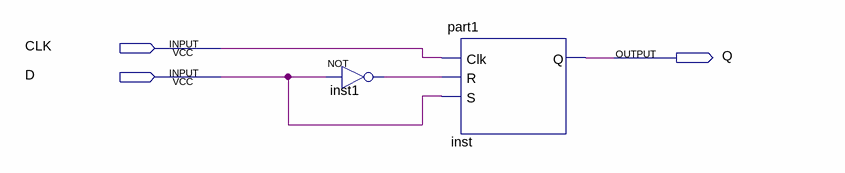
[diagram p0: schematic sheet]
// Quartus schematic part2.bdf as structural Verilog: 2 symbols, 3 pins
module part2 (
  input  CLK,
  input  D,
  output Q
);

  wire inst1_out;

  not inst1 (inst1_out, D);
  part1 inst (.Clk(CLK), .R(inst1_out), .S(D), .Q(Q));
endmodule
